# Altium schematic sheet ADC-TopSheet.SchDoc: <SPECIFIC SHEET FUNCTION>
size A3; Date: DO NOT USE, RATHER USE PROJ OPTIONS; DrawnBy: DO NOT USE, RATHER USE PROJ OPTIONS; Engineer: DO NOT USE, RATHER USE PROJ OPTIONS; Organization: DO NOT USE, RATHER USE PROJ OPTIONS; DocumentNumber: 1; Revision: DO NOT USE, RATHER USE PROJ OPTIONS; SheetNumber: 1; SheetTotal: 12; SCH_Sheet_Filename: ADC-TopSheet.SchDoc; CurrentTime: DO NOT USE, RATHER USE PROJ OPTIONS; Time: DO NOT USE, RATHER USE PROJ OPTIONS; DocumentFullPathAndName: DO NOT USE, RATHER USE PROJ OPTIONS; DocumentName: DO NOT USE, RATHER USE PROJ OPTIONS; ModifiedDate: DO NOT USE, RATHER USE PROJ OPTIONS; ImagePath: DO NOT USE, RATHER USE PROJ OPTIONS
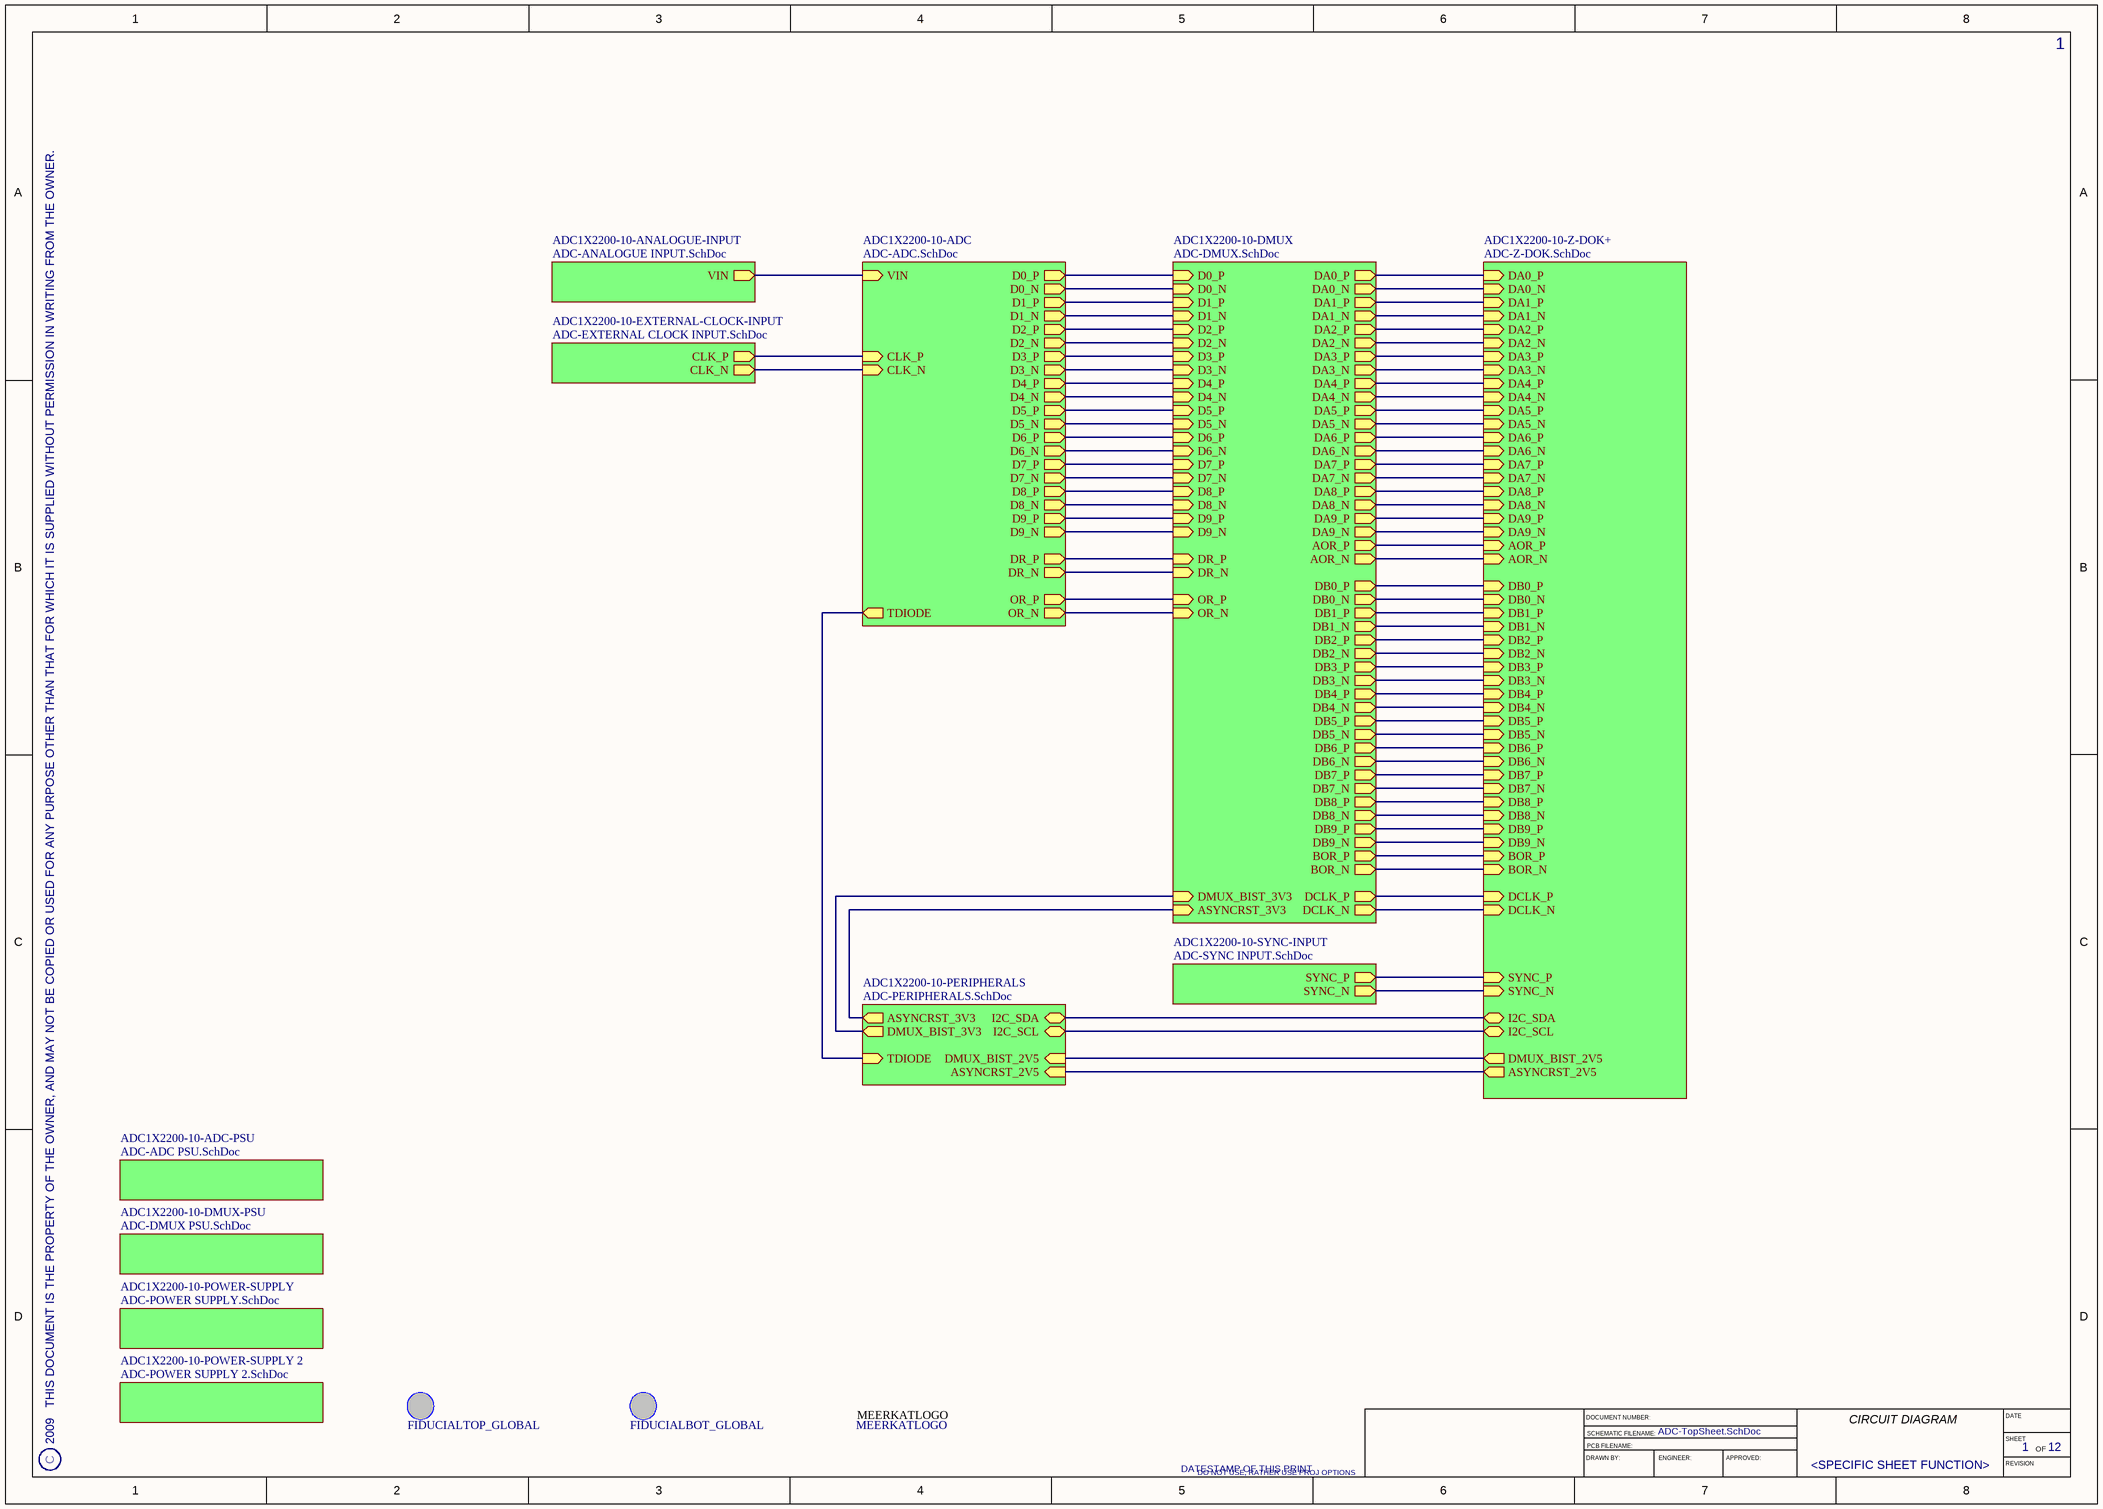
[diagram p0: ADC-TopSheet.SchDoc]

## Parts
F1  FIDUCIALTOP_GLOBAL  [FiducialTop_Global]
F4  FIDUCIALBOT_GLOBAL  [FiducialBot_Global]
LOGO1  MEERKATLOGO  [MEERKATLOGO]

## Sub-sheets
ADC1X2200-10-ADC = ADC-ADC.SchDoc: D0_P (out), D0_N (out), D1_P (out), D1_N (out), D2_P (out), D2_N (out), D3_P (out), D3_N (out), D4_P (out), D4_N (out), D5_P (out), D5_N (out), D6_P (out), D6_N (out), D7_P (out), D7_N (out), D8_P (out), D8_N (out), D9_P (out), D9_N (out), TDIODE (out), VIN (in), CLK_P (in), CLK_N (in), OR_P (out), OR_N (out), DR_P (out), DR_N (out)
ADC1X2200-10-ADC-PSU = ADC-ADC PSU.SchDoc: no entries
ADC1X2200-10-ANALOGUE-INPUT = ADC-ANALOGUE INPUT.SchDoc: VIN (out)
ADC1X2200-10-DMUX = ADC-DMUX.SchDoc: D0_P (in), D0_N (in), D1_P (in), D1_N (in), D2_P (in), D2_N (in), D3_P (in), D3_N (in), D4_P (in), D4_N (in), D5_P (in), D5_N (in), D6_P (in), D6_N (in), D7_P (in), D7_N (in), D8_P (in), D8_N (in), D9_P (in), D9_N (in), DA0_P (out), DA0_N (out), DA1_P (out), DA1_N (out), DA2_P (out), DA2_N (out), DA3_P (out), DA3_N (out), DA4_P (out), DA4_N (out), DA5_P (out), DA5_N (out), DA6_P (out), DA6_N (out), DA7_P (out), DA7_N (out), DA8_P (out), DA8_N (out), DA9_P (out), DA9_N (out), DB0_P (out), DB0_N (out), DB1_P (out), DB1_N (out), DB2_P (out), DB2_N (out), DB3_P (out), DB3_N (out), DB4_P (out), DB4_N (out), DB5_P (out), DB5_N (out), DB6_P (out), DB6_N (out), DB7_P (out), DB7_N (out), DB8_P (out), DB8_N (out), DB9_P (out), DB9_N (out), DCLK_N (out), DCLK_P (out), ASYNCRST_3V3 (in), DR_P (in), DR_N (in), OR_P (in), OR_N (in), AOR_P (out), AOR_N (out), BOR_P (out), BOR_N (out), DMUX_BIST_3V3 (in)
ADC1X2200-10-DMUX-PSU = ADC-DMUX PSU.SchDoc: no entries
ADC1X2200-10-EXTERNAL-CLOCK-INPUT = ADC-EXTERNAL CLOCK INPUT.SchDoc: CLK_P (out), CLK_N (out)
ADC1X2200-10-PERIPHERALS = ADC-PERIPHERALS.SchDoc: TDIODE (in), I2C_SDA (bidir), I2C_SCL, ASYNCRST_2V5 (in), ASYNCRST_3V3 (out), DMUX_BIST_2V5 (in), DMUX_BIST_3V3 (out)
ADC1X2200-10-POWER-SUPPLY = ADC-POWER SUPPLY.SchDoc: no entries
ADC1X2200-10-POWER-SUPPLY 2 = ADC-POWER SUPPLY 2.SchDoc: no entries
ADC1X2200-10-SYNC-INPUT = ADC-SYNC INPUT.SchDoc: SYNC_P (out), SYNC_N (out)
ADC1X2200-10-Z-DOK+ = ADC-Z-DOK.SchDoc: DA0_P (in), DA0_N (in), DA1_P (in), DA1_N (in), DA2_P (in), DA2_N (in), DA3_P (in), DA3_N (in), DA4_P (in), DA4_N (in), DA5_P (in), DA5_N (in), DA6_P (in), DA6_N (in), DA7_P (in), DA7_N (in), DA8_P (in), DA8_N (in), DA9_P (in), DA9_N (in), DB0_P (in), DB0_N (in), DB1_P (in), DB1_N (in), DB2_P (in), DB2_N (in), DB3_P (in), DB3_N (in), DB4_P (in), DB4_N (in), DB5_P (in), DB5_N (in), DB6_P (in), DB6_N (in), DB7_P (in), DB7_N (in), DB8_P (in), DB8_N (in), DB9_P (in), DB9_N (in), I2C_SDA (bidir), I2C_SCL (bidir), ASYNCRST_2V5 (out), SYNC_P (in), SYNC_N (in), DCLK_N (in), DCLK_P (in), AOR_P (in), AOR_N (in), BOR_P (in), BOR_N (in), DMUX_BIST_2V5 (out)

## Nets
(unnamed): sheet ADC1X2200-10-EXTERNAL-CLOCK-INPUT/CLK_P, sheet ADC1X2200-10-ADC/CLK_P
(unnamed): sheet ADC1X2200-10-EXTERNAL-CLOCK-INPUT/CLK_N, sheet ADC1X2200-10-ADC/CLK_N
(unnamed): sheet ADC1X2200-10-ANALOGUE-INPUT/VIN, sheet ADC1X2200-10-ADC/VIN
(unnamed): sheet ADC1X2200-10-PERIPHERALS/TDIODE, sheet ADC1X2200-10-ADC/TDIODE
(unnamed): sheet ADC1X2200-10-PERIPHERALS/I2C_SDA, sheet ADC1X2200-10-Z-DOK+/I2C_SDA
(unnamed): sheet ADC1X2200-10-PERIPHERALS/I2C_SCL, sheet ADC1X2200-10-Z-DOK+/I2C_SCL
(unnamed): sheet ADC1X2200-10-PERIPHERALS/ASYNCRST_2V5, sheet ADC1X2200-10-Z-DOK+/ASYNCRST_2V5
(unnamed): sheet ADC1X2200-10-PERIPHERALS/ASYNCRST_3V3, sheet ADC1X2200-10-DMUX/ASYNCRST_3V3
(unnamed): sheet ADC1X2200-10-PERIPHERALS/DMUX_BIST_2V5, sheet ADC1X2200-10-Z-DOK+/DMUX_BIST_2V5
(unnamed): sheet ADC1X2200-10-PERIPHERALS/DMUX_BIST_3V3, sheet ADC1X2200-10-DMUX/DMUX_BIST_3V3
(unnamed): sheet ADC1X2200-10-DMUX/D0_P, sheet ADC1X2200-10-ADC/D0_P
(unnamed): sheet ADC1X2200-10-DMUX/D0_N, sheet ADC1X2200-10-ADC/D0_N
(unnamed): sheet ADC1X2200-10-DMUX/D1_P, sheet ADC1X2200-10-ADC/D1_P
(unnamed): sheet ADC1X2200-10-DMUX/D1_N, sheet ADC1X2200-10-ADC/D1_N
(unnamed): sheet ADC1X2200-10-DMUX/D2_P, sheet ADC1X2200-10-ADC/D2_P
(unnamed): sheet ADC1X2200-10-DMUX/D2_N, sheet ADC1X2200-10-ADC/D2_N
(unnamed): sheet ADC1X2200-10-DMUX/D3_P, sheet ADC1X2200-10-ADC/D3_P
(unnamed): sheet ADC1X2200-10-DMUX/D3_N, sheet ADC1X2200-10-ADC/D3_N
(unnamed): sheet ADC1X2200-10-DMUX/D4_P, sheet ADC1X2200-10-ADC/D4_P
(unnamed): sheet ADC1X2200-10-DMUX/D4_N, sheet ADC1X2200-10-ADC/D4_N
(unnamed): sheet ADC1X2200-10-DMUX/D5_P, sheet ADC1X2200-10-ADC/D5_P
(unnamed): sheet ADC1X2200-10-DMUX/D5_N, sheet ADC1X2200-10-ADC/D5_N
(unnamed): sheet ADC1X2200-10-DMUX/D6_P, sheet ADC1X2200-10-ADC/D6_P
(unnamed): sheet ADC1X2200-10-DMUX/D6_N, sheet ADC1X2200-10-ADC/D6_N
(unnamed): sheet ADC1X2200-10-DMUX/D7_P, sheet ADC1X2200-10-ADC/D7_P
(unnamed): sheet ADC1X2200-10-DMUX/D7_N, sheet ADC1X2200-10-ADC/D7_N
(unnamed): sheet ADC1X2200-10-DMUX/D8_P, sheet ADC1X2200-10-ADC/D8_P
(unnamed): sheet ADC1X2200-10-DMUX/D8_N, sheet ADC1X2200-10-ADC/D8_N
(unnamed): sheet ADC1X2200-10-DMUX/D9_P, sheet ADC1X2200-10-ADC/D9_P
(unnamed): sheet ADC1X2200-10-DMUX/D9_N, sheet ADC1X2200-10-ADC/D9_N
(unnamed): sheet ADC1X2200-10-DMUX/DA0_P, sheet ADC1X2200-10-Z-DOK+/DA0_P
(unnamed): sheet ADC1X2200-10-DMUX/DA0_N, sheet ADC1X2200-10-Z-DOK+/DA0_N
(unnamed): sheet ADC1X2200-10-DMUX/DA1_P, sheet ADC1X2200-10-Z-DOK+/DA1_P
(unnamed): sheet ADC1X2200-10-DMUX/DA1_N, sheet ADC1X2200-10-Z-DOK+/DA1_N
(unnamed): sheet ADC1X2200-10-DMUX/DA2_P, sheet ADC1X2200-10-Z-DOK+/DA2_P
(unnamed): sheet ADC1X2200-10-DMUX/DA2_N, sheet ADC1X2200-10-Z-DOK+/DA2_N
(unnamed): sheet ADC1X2200-10-DMUX/DA3_P, sheet ADC1X2200-10-Z-DOK+/DA3_P
(unnamed): sheet ADC1X2200-10-DMUX/DA3_N, sheet ADC1X2200-10-Z-DOK+/DA3_N
(unnamed): sheet ADC1X2200-10-DMUX/DA4_P, sheet ADC1X2200-10-Z-DOK+/DA4_P
(unnamed): sheet ADC1X2200-10-DMUX/DA4_N, sheet ADC1X2200-10-Z-DOK+/DA4_N
(unnamed): sheet ADC1X2200-10-DMUX/DA5_P, sheet ADC1X2200-10-Z-DOK+/DA5_P
(unnamed): sheet ADC1X2200-10-DMUX/DA5_N, sheet ADC1X2200-10-Z-DOK+/DA5_N
(unnamed): sheet ADC1X2200-10-DMUX/DA6_P, sheet ADC1X2200-10-Z-DOK+/DA6_P
(unnamed): sheet ADC1X2200-10-DMUX/DA6_N, sheet ADC1X2200-10-Z-DOK+/DA6_N
(unnamed): sheet ADC1X2200-10-DMUX/DA7_P, sheet ADC1X2200-10-Z-DOK+/DA7_P
(unnamed): sheet ADC1X2200-10-DMUX/DA7_N, sheet ADC1X2200-10-Z-DOK+/DA7_N
(unnamed): sheet ADC1X2200-10-DMUX/DA8_P, sheet ADC1X2200-10-Z-DOK+/DA8_P
(unnamed): sheet ADC1X2200-10-DMUX/DA8_N, sheet ADC1X2200-10-Z-DOK+/DA8_N
(unnamed): sheet ADC1X2200-10-DMUX/DA9_P, sheet ADC1X2200-10-Z-DOK+/DA9_P
(unnamed): sheet ADC1X2200-10-DMUX/DA9_N, sheet ADC1X2200-10-Z-DOK+/DA9_N
(unnamed): sheet ADC1X2200-10-DMUX/DB0_P, sheet ADC1X2200-10-Z-DOK+/DB0_P
(unnamed): sheet ADC1X2200-10-DMUX/DB0_N, sheet ADC1X2200-10-Z-DOK+/DB0_N
(unnamed): sheet ADC1X2200-10-DMUX/DB1_P, sheet ADC1X2200-10-Z-DOK+/DB1_P
(unnamed): sheet ADC1X2200-10-DMUX/DB1_N, sheet ADC1X2200-10-Z-DOK+/DB1_N
(unnamed): sheet ADC1X2200-10-DMUX/DB2_P, sheet ADC1X2200-10-Z-DOK+/DB2_P
(unnamed): sheet ADC1X2200-10-DMUX/DB2_N, sheet ADC1X2200-10-Z-DOK+/DB2_N
(unnamed): sheet ADC1X2200-10-DMUX/DB3_P, sheet ADC1X2200-10-Z-DOK+/DB3_P
(unnamed): sheet ADC1X2200-10-DMUX/DB3_N, sheet ADC1X2200-10-Z-DOK+/DB3_N
(unnamed): sheet ADC1X2200-10-DMUX/DB4_P, sheet ADC1X2200-10-Z-DOK+/DB4_P
(unnamed): sheet ADC1X2200-10-DMUX/DB4_N, sheet ADC1X2200-10-Z-DOK+/DB4_N
(unnamed): sheet ADC1X2200-10-DMUX/DB5_P, sheet ADC1X2200-10-Z-DOK+/DB5_P
(unnamed): sheet ADC1X2200-10-DMUX/DB5_N, sheet ADC1X2200-10-Z-DOK+/DB5_N
(unnamed): sheet ADC1X2200-10-DMUX/DB6_P, sheet ADC1X2200-10-Z-DOK+/DB6_P
(unnamed): sheet ADC1X2200-10-DMUX/DB6_N, sheet ADC1X2200-10-Z-DOK+/DB6_N
(unnamed): sheet ADC1X2200-10-DMUX/DB7_P, sheet ADC1X2200-10-Z-DOK+/DB7_P
(unnamed): sheet ADC1X2200-10-DMUX/DB7_N, sheet ADC1X2200-10-Z-DOK+/DB7_N
(unnamed): sheet ADC1X2200-10-DMUX/DB8_P, sheet ADC1X2200-10-Z-DOK+/DB8_P
(unnamed): sheet ADC1X2200-10-DMUX/DB8_N, sheet ADC1X2200-10-Z-DOK+/DB8_N
(unnamed): sheet ADC1X2200-10-DMUX/DB9_P, sheet ADC1X2200-10-Z-DOK+/DB9_P
(unnamed): sheet ADC1X2200-10-DMUX/DB9_N, sheet ADC1X2200-10-Z-DOK+/DB9_N
(unnamed): sheet ADC1X2200-10-DMUX/DCLK_N, sheet ADC1X2200-10-Z-DOK+/DCLK_N
(unnamed): sheet ADC1X2200-10-DMUX/DCLK_P, sheet ADC1X2200-10-Z-DOK+/DCLK_P
(unnamed): sheet ADC1X2200-10-DMUX/DR_P, sheet ADC1X2200-10-ADC/DR_P
(unnamed): sheet ADC1X2200-10-DMUX/DR_N, sheet ADC1X2200-10-ADC/DR_N
(unnamed): sheet ADC1X2200-10-DMUX/OR_P, sheet ADC1X2200-10-ADC/OR_P
(unnamed): sheet ADC1X2200-10-DMUX/OR_N, sheet ADC1X2200-10-ADC/OR_N
(unnamed): sheet ADC1X2200-10-DMUX/AOR_P, sheet ADC1X2200-10-Z-DOK+/AOR_P
(unnamed): sheet ADC1X2200-10-DMUX/AOR_N, sheet ADC1X2200-10-Z-DOK+/AOR_N
(unnamed): sheet ADC1X2200-10-DMUX/BOR_P, sheet ADC1X2200-10-Z-DOK+/BOR_P
(unnamed): sheet ADC1X2200-10-DMUX/BOR_N, sheet ADC1X2200-10-Z-DOK+/BOR_N
(unnamed): sheet ADC1X2200-10-Z-DOK+/SYNC_P, sheet ADC1X2200-10-SYNC-INPUT/SYNC_P
(unnamed): sheet ADC1X2200-10-Z-DOK+/SYNC_N, sheet ADC1X2200-10-SYNC-INPUT/SYNC_N

## Notes on the sheet
- 2009   THIS DOCUMENT IS THE PROPERTY OF THE OWNER, AND MAY NOT BE COPIED OR USED FOR ANY PURPOSE OTHER THAN THAT FOR WHICH IT IS SUPPLIED WITHOUT PERMISSION IN WRITING FROM THE OWNER.
- C
- DATESTAMP OF THIS PRINT
- DRAWN BY:
- DOCUMENT NUMBER:
- SCHEMATIC FILENAME:
- PCB FILENAME:
- ENGINEER:
- APPROVED:
- CIRCUIT DIAGRAM
- DATE
- SHEET
- REVISION
- OF

## Library data of the parts
F1 = FIDUCIALTOP_GLOBAL: Value: ????; Manufacturer: *; Manufacturer_PN: *; Created_By: *; Checked_By: *; Checked_Date: *; HelpURL: *; ComponentLink1Description: Footprint Detail; ComponentLink1URL: *; ComponentLink2Description: Application Note; ComponentLink2URL: *; ComponentLink3Description: Layout Guidelines; ComponentLink3URL: *; ComponentLink4Description: Technology Reference; ComponentLink4URL: *; Supplier1: *; Supplier2: *; Unit_Cost: *; MOQ: *; Leadtime: *; Inventory_Stock: *; Tolerance: *; Wattage: *; Voltage: *; Package: *; ComponentLink5Description: Production Detail; ComponentLink5URL: *; Note: *; Stock Code: *
F4 = FIDUCIALBOT_GLOBAL: Value: ????; Manufacturer: *; Manufacturer_PN: *; Created_By: *; Checked_By: *; Checked_Date: *; HelpURL: *; ComponentLink1Description: Footprint Detail; ComponentLink1URL: *; ComponentLink2Description: Application Note; ComponentLink2URL: *; ComponentLink3Description: Layout Guidelines; ComponentLink3URL: *; ComponentLink4Description: Technology Reference; ComponentLink4URL: *; Supplier1: *; Supplier2: *; Unit_Cost: *; MOQ: *; Leadtime: *; Inventory_Stock: *; Tolerance: *; Wattage: *; Voltage: *; Package: *; ComponentLink5Description: Production Detail; ComponentLink5URL: *; Note: *; Stock Code: *